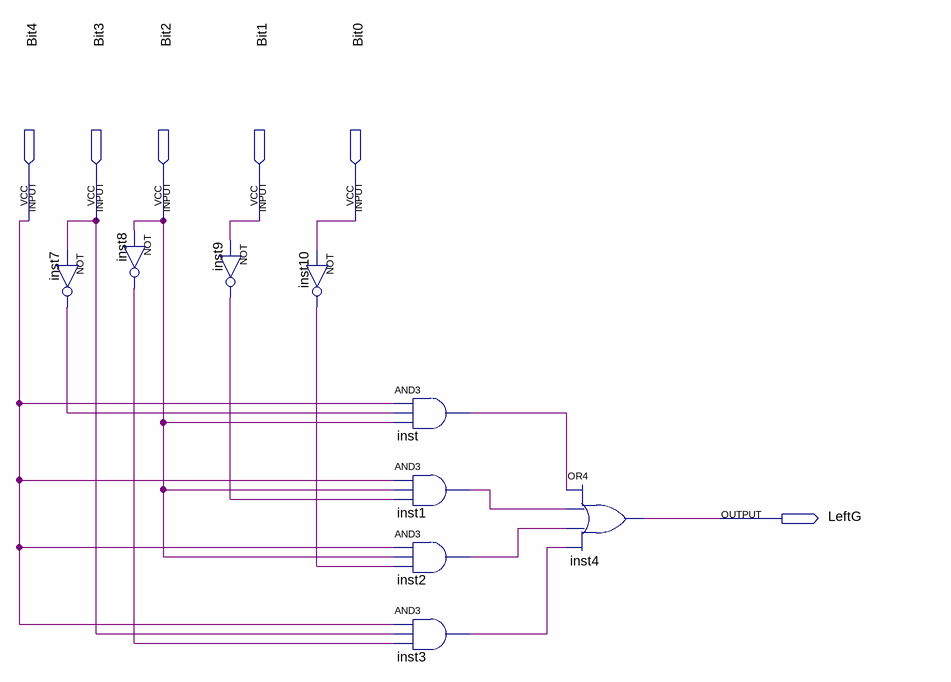
[diagram p0: schematic sheet]
// Quartus schematic LeftG.bdf as structural Verilog: 9 symbols, 6 pins
module LeftG (
  input  Bit4,
  input  Bit3,
  input  Bit2,
  input  Bit1,
  input  Bit0,
  output LeftG
);

  wire inst1_out, inst2_out, inst3_out, inst7_out, inst8_out, inst9_out, inst10_out, inst_out;

  not inst8 (inst8_out, Bit2);
  not inst7 (inst7_out, Bit3);
  not inst9 (inst9_out, Bit1);
  not inst10 (inst10_out, Bit0);
  and inst (inst_out, Bit4, inst7_out, Bit2);
  and inst1 (inst1_out, Bit4, Bit2, inst9_out);
  and inst2 (inst2_out, Bit4, Bit2, inst10_out);
  and inst3 (inst3_out, Bit4, Bit3, inst8_out);
  or inst4 (LeftG, inst_out, inst1_out, inst2_out, inst3_out);
endmodule
